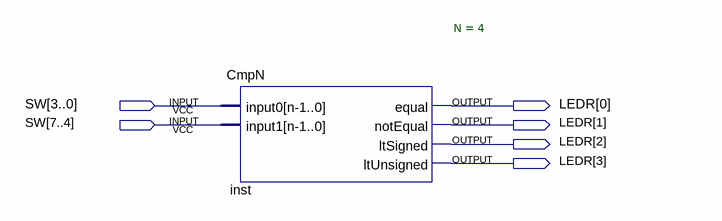
[diagram p0: schematic sheet]
// Quartus schematic CmpN_Demo.bdf as structural Verilog: 1 symbols, 6 pins
module CmpN_Demo (
  input  [7:0] SW,
  output [3:0] LEDR
);

  CmpN #(.N(4)) inst (
    .input0(SW[3:0]), .input1(SW[7:4]), .equal(LEDR[0]), .notEqual(LEDR[1]), .ltSigned(LEDR[2]),
    .ltUnsigned(LEDR[3]));
endmodule
